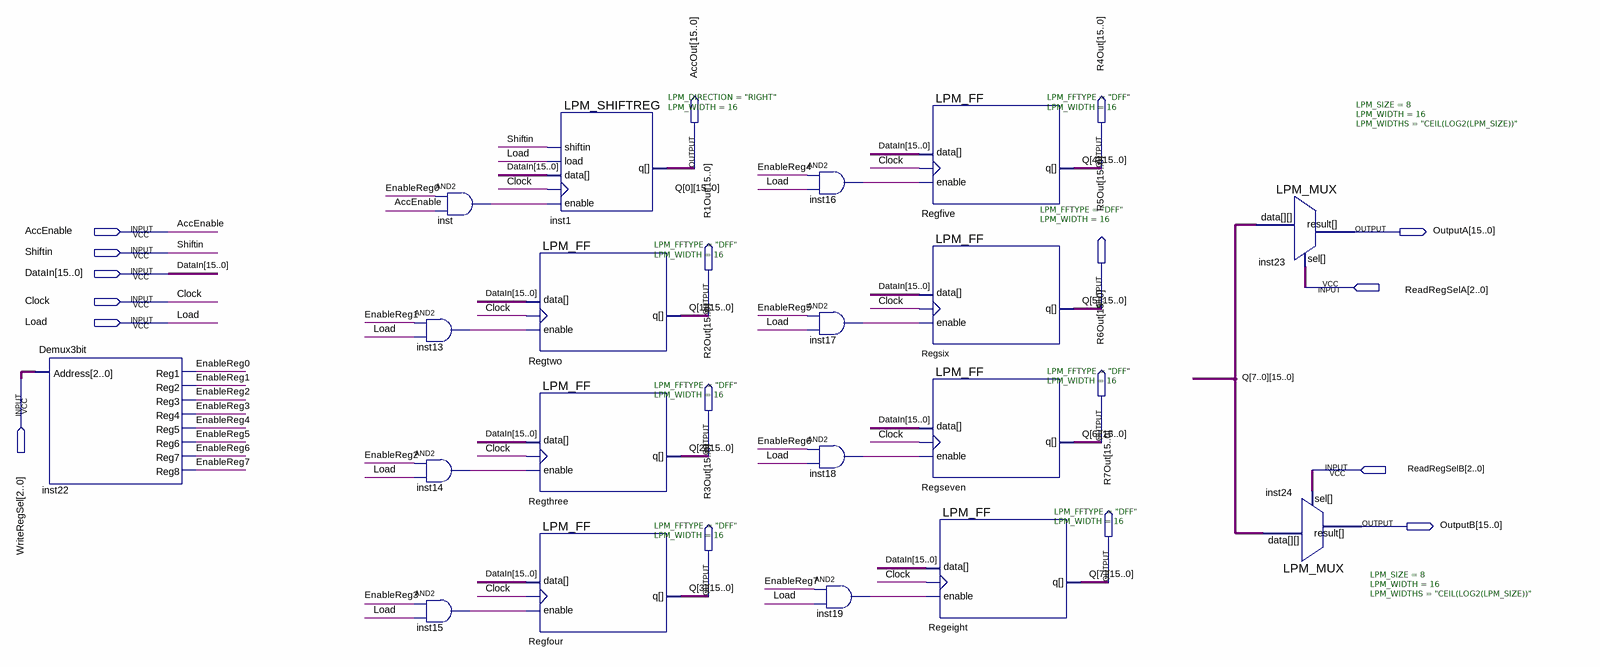
[diagram p0: schematic sheet]
// Quartus schematic RegisterFile.bdf as structural Verilog: 19 symbols, 18 pins
module RegisterFile (
  input  AccEnable,
  input  Shiftin,
  input  [15:0] DataIn,
  input  [2:0] ReadRegSelA,
  input  Clock,
  input  Load,
  input  [2:0] WriteRegSel,
  input  [2:0] ReadRegSelB,
  output [15:0] AccOut,
  output [15:0] R4Out,
  output [15:0] OutputA,
  output [15:0] R5Out,
  output [15:0] R1Out,
  output [15:0] R6Out,
  output [15:0] R2Out,
  output [15:0] OutputB,
  output [15:0] R7Out,
  output [15:0] R3Out
);

  wire EnableReg0, EnableReg1, EnableReg2, EnableReg3, EnableReg4, EnableReg5, EnableReg6, EnableReg7,
       inst13_out, inst14_out, inst15_out, inst16_out, inst17_out, inst18_out, inst19_out, inst_out;

  Demux3bit inst22 (
    .Address(WriteRegSel), .Reg1(EnableReg0), .Reg2(EnableReg1), .Reg3(EnableReg2), .Reg4(EnableReg3),
    .Reg5(EnableReg4), .Reg6(EnableReg5), .Reg7(EnableReg6), .Reg8(EnableReg7));
  and inst (inst_out, EnableReg0, AccEnable);
  and inst13 (inst13_out, EnableReg1, Load);
  and inst14 (inst14_out, EnableReg2, Load);
  and inst15 (inst15_out, EnableReg3, Load);
  LPM_SHIFTREG #(.LPM_DIRECTION("RIGHT"), .LPM_WIDTH(16)) inst1 (
    .clock(Clock), .data(DataIn), .enable(inst_out), .load(Load), .shiftin(Shiftin), .q(AccOut));
  LPM_FF #(.LPM_FFTYPE("DFF"), .LPM_WIDTH(16)) Regtwo (.clock(Clock), .data(DataIn), .enable(inst13_out), .q(R1Out));
  LPM_FF #(.LPM_FFTYPE("DFF"), .LPM_WIDTH(16)) Regthree (.clock(Clock), .data(DataIn), .enable(inst14_out), .q(R2Out));
  LPM_FF #(.LPM_FFTYPE("DFF"), .LPM_WIDTH(16)) Regfour (.clock(Clock), .data(DataIn), .enable(inst15_out), .q(R3Out));
  and inst16 (inst16_out, EnableReg4, Load);
  and inst17 (inst17_out, EnableReg5, Load);
  and inst18 (inst18_out, EnableReg6, Load);
  and inst19 (inst19_out, EnableReg7, Load);
  LPM_FF #(.LPM_FFTYPE("DFF"), .LPM_WIDTH(16)) Regfive (.clock(Clock), .data(DataIn), .enable(inst16_out), .q(R4Out));
  LPM_FF #(.LPM_FFTYPE("DFF"), .LPM_WIDTH(16)) Regsix (.clock(Clock), .data(DataIn), .enable(inst17_out), .q(R5Out));
  LPM_FF #(.LPM_FFTYPE("DFF"), .LPM_WIDTH(16)) Regseven (.clock(Clock), .data(DataIn), .enable(inst18_out), .q(R6Out));
  LPM_FF #(.LPM_FFTYPE("DFF"), .LPM_WIDTH(16)) Regeight (.clock(Clock), .data(DataIn), .enable(inst19_out), .q(R7Out));
  LPM_MUX #(.LPM_SIZE(8), .LPM_WIDTH(16), .LPM_WIDTHS("CEIL(LOG2(LPM_SIZE))")) inst23 (
    .data({R7Out, R6Out, R5Out, R4Out, R3Out, R2Out, R1Out, AccOut}), .sel(ReadRegSelA), .result(OutputA));
  LPM_MUX #(.LPM_SIZE(8), .LPM_WIDTH(16), .LPM_WIDTHS("CEIL(LOG2(LPM_SIZE))")) inst24 (
    .data({R7Out, R6Out, R5Out, R4Out, R3Out, R2Out, R1Out, AccOut}), .sel(ReadRegSelB), .result(OutputB));

  // Other names for the same wires on the sheet: Q_0[15:0] = AccOut; Q_1[15:0] = R1Out; Q_2[15:0] = R2Out;
  //   Q_3[15:0] = R3Out; Q_4[15:0] = R4Out; Q_5[15:0] = R5Out; Q_6[15:0] = R6Out; Q_7[15:0] = R7Out
endmodule
